# EAGLE design smc (EAGLE 9.6.2)
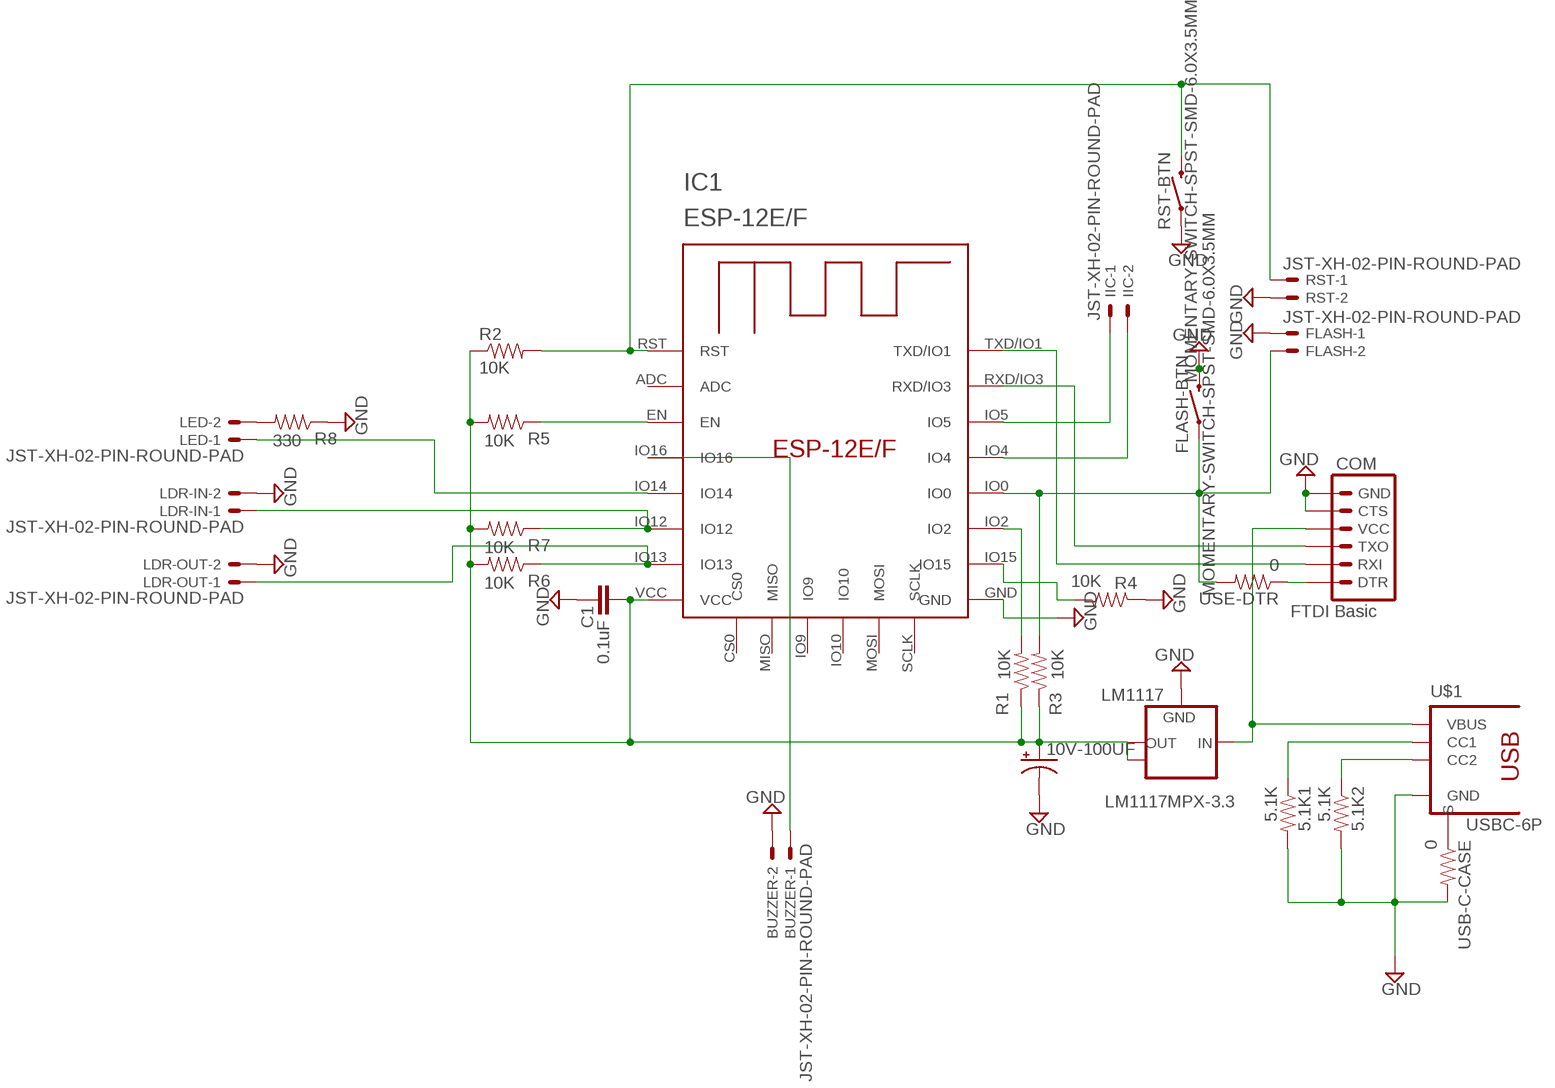
[diagram p0: schematic, sheet 1]

## Parts
5.1K1  5.1K  RESISTOR0603-RES  [0603-RES]
5.1K2  5.1K  RESISTOR0603-RES  [0603-RES]
10V-100UF  CPOL-USA/3216-18W  [A/3216-18W]
BUZZER  JST-XH-02-PIN-ROUND-PAD  [JST-XH-02-PACKAGE-ROUND-PAD]
C1  0.1uF  CAP0603-CAP  [0603-CAP]
COM  FTDI Basic  ARDUINO_SERIAL_PROGRAMPTH  [1X06]
FLASH  JST-XH-02-PIN-ROUND-PAD  [JST-XH-02-PACKAGE-ROUND-PAD]
FLASH-BTN  MOMENTARY-SWITCH-SPST-SMD-6.0X3.5MM  [TACTILE_SWITCH_SMD_6.0X3.5MM]
IC1  ESP-12E/F  [ESP-12E]
IIC  JST-XH-02-PIN-ROUND-PAD  [JST-XH-02-PACKAGE-ROUND-PAD]
LDR-IN  JST-XH-02-PIN-ROUND-PAD  [JST-XH-02-PACKAGE-ROUND-PAD]
LDR-OUT  JST-XH-02-PIN-ROUND-PAD  [JST-XH-02-PACKAGE-ROUND-PAD]
LED  JST-XH-02-PIN-ROUND-PAD  [JST-XH-02-PACKAGE-ROUND-PAD]
LM1117  LM1117MPX-3.3  [SOT223]
R1  10K  RESISTOR0603-RES  [0603-RES]
R2  10K  RESISTOR0603-RES  [0603-RES]
R3  10K  RESISTOR0603-RES  [0603-RES]
R4  10K  RESISTOR0603-RES  [0603-RES]
R5  10K  RESISTOR0603-RES  [0603-RES]
R6  10K  RESISTOR0603-RES  [0603-RES]
R7  10K  RESISTOR0603-RES  [0603-RES]
R8  330  RESISTOR0603-RES  [0603-RES]
RST  JST-XH-02-PIN-ROUND-PAD  [JST-XH-02-PACKAGE-ROUND-PAD]
RST-BTN  MOMENTARY-SWITCH-SPST-SMD-6.0X3.5MM  [TACTILE_SWITCH_SMD_6.0X3.5MM]
U$1  USBC-6P  [USCX-06FX-XXMX-01]
USB-C-CASE  0  RESISTOR0603-RES  [0603-RES]
USE-DTR  0  RESISTOR0603-RES  [0603-RES]

## Nets
3V3: 10V-100UF.+ C1.1 IC1.VCC LM1117.2(OUT) LM1117.TAB(OUT1) R1.1 R2.1 R3.1 R5.2 R6.2 R7.2
5V: COM.4(VCC) LM1117.3(IN) U$1.VBUS1(VBUS) U$1.VBUS2(VBUS)
GND: 5.1K1.2 5.1K2.2 10V-100UF.- BUZZER.2 C1.2 COM.5(CTS) COM.6(GND) FLASH-BTN.2 FLASH.1 IC1.GND LDR-IN.2 LDR-OUT.2 LM1117.1(GND) R4.1 R8.1 RST-BTN.1 RST.2 U$1.GND1(GND) U$1.GND2(GND) USB-C-CASE.2
IO0: FLASH-BTN.1 FLASH.2 IC1.IO0 R3.2 USE-DTR.2
IO2: IC1.IO2 R1.2
N$1: IC1.IO15 R4.2
N$2: IC1.EN R5.1
N$3: IC1.IO12 LDR-IN.1 R7.1
N$4: IC1.IO13 LDR-OUT.1 R6.1
N$5: LED.2 R8.2
N$6: COM.3(TXO) IC1.RXD/IO3
N$7: COM.2(RXI) IC1.TXD/IO1
N$8: COM.1(DTR) USE-DTR.1
N$9: U$1.SHIELD1(S) U$1.SHIELD2(S) U$1.SHIELD3(S) U$1.SHIELD4(S) USB-C-CASE.1
N$10: IC1.IO14 LED.1
N$11: 5.1K2.1 U$1.CC2
N$12: 5.1K1.1 U$1.CC1
N$13: BUZZER.1 IC1.IO16
N$14: IC1.IO5 IIC.1
N$15: IC1.IO4 IIC.2
RST: IC1.RST R2.2 RST-BTN.2 RST.1
Unconnected: IC1.ADC IC1.CS0 IC1.IO9 IC1.IO10 IC1.MISO IC1.MOSI IC1.SCLK

## Library data of the parts
5.1K1 5.1K2 R1-R8 USB-C-CASE USE-DTR = SparkFun:RESISTOR: Resistor Basic schematic elements and footprints for 0603, 1206, and PTH resistors.
10V-100UF = rcl:CPOL-US: POLARIZED CAPACITOR, American symbol; SPICEPREFIX: C
BUZZER FLASH IIC LDR-IN LDR-OUT LED RST = Rembrandt Electronics - JST XH Connectors v1-0:JST-XH-02-PIN: JST XH Connector 2 Pin Wire to board connector. Pitch: 2,54 mm, (0.100") Number of pins: 2 Created by Rembrandt Electronics www.rembrandtelectronics.com
C1 = SparkFun:CAP: Capacitor Standard 0603 ceramic capacitor, and 0.1" leaded capacitor.
COM = SparkFun:ARDUINO_SERIAL_PROGRAM
FLASH-BTN RST-BTN = SparkFun-Switches:MOMENTARY-SWITCH-SPST: Momentary Switch (Pushbutton) - SPST Normally-open (NO) SPST momentary switches (buttons, pushbuttons). Variants PTH-12MM - 12mm square, through-hole Momentary Pushbutton Switch - 12mm Square <https://www.sparkfun.com/products/9190> (COM-09190) PTH-6.0MM, PTH-6.0MM-KIT - 6.0mm square, through-hole Mini Pushbutton Switch <https://www.sparkfun.com/products/97> (COM-00097) KIT package intended for soldering kit's - only one side of pads' copper is exposed. PTH-RIGHT-ANGLE-KIT - Right-angle, through-hole Right Angle Tactile Button <https://www.sparkfun.com/products/10791> - Used on SparkFun BigTime Watch Kit <https://www.sparkfun.com/products/11734> SMD-12MM - 12mm square, surface-mount Tactile Button - SMD (12mm) <https://www.sparkfun.com/products/12993> (COM-12993) Used on SparkFun PicoBoard <https://www.sparkfun.com/products/11888> SMD-4.5MM - 4.5mm Square Trackball Switch Used on SparkFun Blackberry Trackballer Breakout <https://www.sparkfun.com/products/13169> SMD-4.6MMX2.8MM - 4.60mm x 2.80mm, surface mount Used on SparkFun SAMD21 Mini Breakout <https://www.sparkfun.com/products/13664> SMD-5.2MM, SMD-5.2-REDUNDANT - 5.2mm square, surface-mount Mini Pushbutton Switch - SMD <https://www.sparkfun.com/products/8720> (COM-08720) Used on Arduino Pro Mini <https://www.sparkfun.com/products/11114> REDUNDANT package connects both switch circuits together SMD-6.0X3.5MM - 6.0 x 3.5mm, surface mount Momentary Reset Switch SMD <https://www.sparkfun.com/products/8229> (COM-08229) SMD-6.2MM-TALL - 6.2mm square, surface mount Tactile Button - SMD (6mm) <https://www.sparkfun.com/products/12992> Used on SparkFun Digital Sandbox <https://www.sparkfun.com/products/12651> SMD-RIGHT-ANGLE - Right-angle, surface mount Used on SparkFun Block for Intel® Edison - Arduino <https://www.sparkfun.com/products/13036>; PROD_ID: SWCH-00815; SF_SKU: COM-08229
IC1 = esp-12e-f:ESP-12E/F
LM1117 = lm1117:LM1117MPX-*
U$1 = USBC6P:USBC-6P: AliExpress Special! Connect 5.1k 10% resistors to each CC pin, pulled up to 3.3v or 5.0v.

## Board
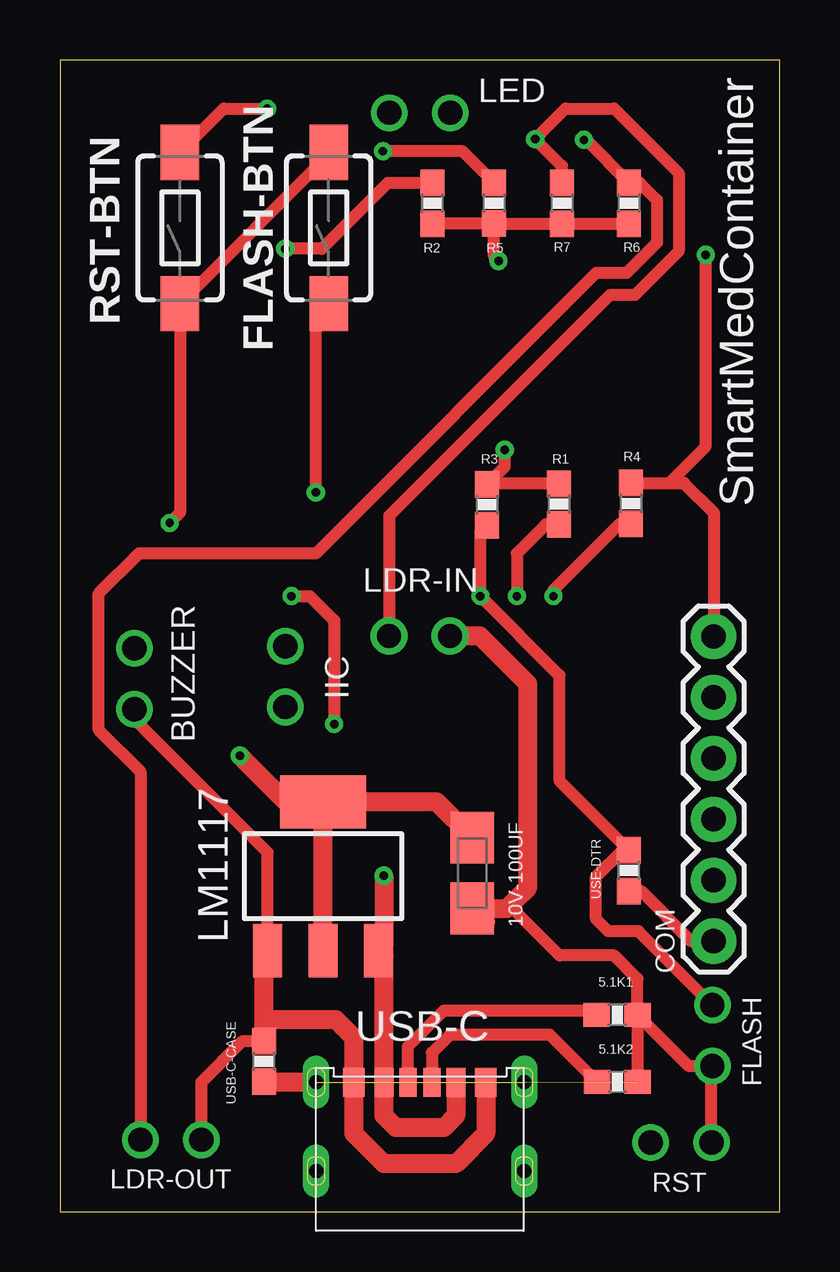
[diagram p1: board, top side]
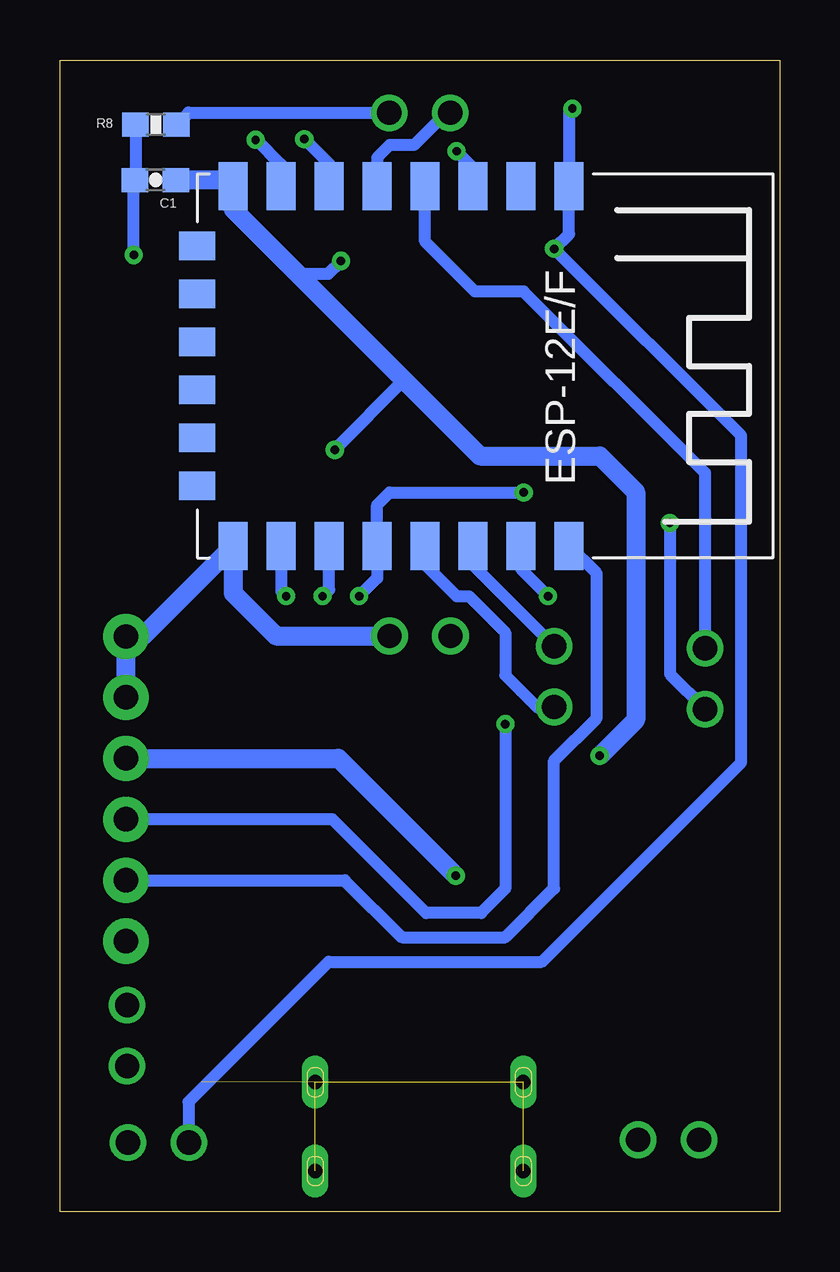
[diagram p2: board, bottom side, seen from below]

Size 30 x 48 mm. Coordinates in mm from the lower left corner, seen from the top.
Outline: 0,0 30,0 30,48 0,48 0,0
Copper layers (1*16): Top 0.035mm / dielectric 1.5mm / Bottom 0.035mm
Design rules "default *": minimum track width 6mil, minimum drill 0.35mm, track to track 10mil, track to pad 8mil, pad to pad 6mil, via to via 10mil, smd to smd 10mil, copper to edge 40mil, drill to drill 8mil, minimum pad ring 10mil, minimum via ring 8mil, stop-mask expansion 4mil, vias tented up to drill 0mil, thermal gap 10mil

### Footprints (pad centres in the part's own frame; a part is rotated, then mirrored left to right if it is on the bottom)
0603-RES = smd 1.1 x 1: 1 -0.85,0; 2 0.85,0
A/3216-18W = smd 2.15 x 1.8: + 1.475,0; - -1.475,0
JST-XH-02-PACKAGE-ROUND-PAD = drill 1.016: 1 -1.27,0; 2 1.27,0
0603-CAP = smd 1.1 x 1: 1 -0.85,0; 2 0.85,0
1X06 = drill 1.016 pad 1.88: 1 0,0; 2 2.54,0; 3 5.08,0; 4 7.62,0; 5 10.16,0; 6 12.7,0
TACTILE_SWITCH_SMD_6.0X3.5MM = smd 2.3 x 1.6: 1 -3.15,0; 2 3.15,0
ESP-12E = smd 2 x 1.2: ADC -7.46,5.53; EN -7.46,3.53; GND 7.54,-6.47; IO0 7.54,-0.47; IO2 7.54,-2.47; IO4 7.54,1.53; IO5 7.54,3.53; IO12 -7.46,-2.47; IO13 -7.46,-4.47; IO14 -7.46,-0.47; IO15 7.54,-4.47; IO16 -7.46,1.53; RST -7.46,7.53; RXD/IO3 7.54,5.53; TXD/IO1 7.54,7.53; VCC -7.46,-6.47 | smd 1.2 x 1.5: CS0 -4.96,-7.97; IO9 -0.96,-7.97; IO10 1.04,-7.97; MISO -2.96,-7.97; MOSI 3.04,-7.97; SCLK 5.04,-7.97
SOT223 = smd 1.219 x 2.235: 1 -2.311,-3.099; 2 0,-3.099; 3 2.311,-3.099 | smd 3.6 x 2.2: TAB 0,3.099
USCX-06FX-XXMX-01 = smd 0.7 x 1.2: CC1 0.5,-1.75; CC2 -0.5,-1.75 | smd 0.9 x 1.2: GND1 2.75,-1.75; GND2 -2.75,-1.75 | drill 0.6 long: SHIELD1 4.325,1.95; SHIELD2 4.325,-1.75; SHIELD3 -4.35,-1.75; SHIELD4 -4.35,1.95 | smd 0.8 x 1.2: VBUS1 1.5,-1.75; VBUS2 -1.5,-1.75

### Placement (x,y rotation side)
5.1K1  23.23,8.2 0 top
5.1K2  23.24,5.4 0 top
10V-100UF  17.19,14.11 90 top
BUZZER  3.1,22.21 270 top
C1  26.02,43 180 bottom
COM  27.25,11.27 90 top
FLASH  27.2,7.33 90 top
FLASH-BTN  11.2,41 90 top
IC1  16.31,35.29 270 bottom
IIC  9.4,22.3 270 top
LDR-IN  14.99,23.99 0 top
LDR-OUT  4.63,2.99 0 top
LED  15,45.8 0 top
LM1117  10.97,13.98 0 top
R1  20.8,29.49 270 top
R2  15.53,42.02 90 top
R3  17.8,29.46 270 top
R4  23.8,29.52 270 top
R5  18.1,42.03 270 top
R6  23.73,42.02 270 top
R7  20.94,42.02 270 top
R8  26,45.3 0 bottom
RST  25.89,2.88 0 top
RST-BTN  5,41 90 top
U$1  15.01,3.64 180 top
USB-C-CASE  8.5,6.26 90 top
USE-DTR  23.72,14.21 90 top

### Tracks (layer width: path | path; a pad name or v marks a point on that pad's centre or on a via)
3V3  (via drill 0.35)
  Top 0.5: v18.29,39.62 18.1,39.81 R5.2 | R5.2 R7.2 R6.2 | R5.2 R2.1 | R1.1 17.83,30.34 R3.1 18.54,31.05 v18.54,31.75
  Top 0.8: LM1117.2 LM1117.TAB | 10V-100UF.+ 15.7,17.08 LM1117.TAB | v7.5,19 9.42,17.08 LM1117.TAB
  Bottom 0.5: 20.09,39.09 18.82,39.09 v18.29,39.62 | v18.54,31.75 15.65,34.65
  Bottom 0.8: C1.1 23.03,43 IC1.VCC 22.78,41.78 20.09,39.09 15.65,34.65 12.5,31.5 7.5,31.5 6,30 6,20.5 v7.5,19
5V  (via drill 0.35)
  Top 0.8: 13.51,10.66 13.5,10.65 U$1.VBUS1 13.51,4 14,3.5 16,3.5 16.5,4 U$1.VBUS2 | v13.5,14 13.5,11.1 LM1117.3
  Top 0.813: 13.51,10.66 LM1117.3
  Bottom 0.8: COM.4 18.39,18.89 v13.5,14
GND  (via drill 0.35)  (1 unrouted)
  Top 0.5: RST.2 27.16,6.02 FLASH.1 26.22,6.06 5.1K1.2 | 5.1K2.2 5.1K1.2 | 5.1K1.2 24.08,9.7 23.11,10.67 20.83,10.67 19,12.49 19,13 | LDR-OUT.2 5.9,5.39 7.62,7.11 USB-C-CASE.2 | LM1117.1 8.66,14.96 3.1,20.52 BUZZER.2 | R4.1 25.4,30.37 | 25.4,30.37 26.02,30.37 27.25,29.14 COM.6 | 25.4,30.37 26.92,31.89 v26.92,39.88 | v4.57,28.7 5,29.13 RST-BTN.1 11.2,44.05 FLASH-BTN.2
  Top 0.8: USB-C-CASE.2 8.5,8 | 8.5,8 8.5,10.72 LM1117.1 | 8.5,8 11.5,8 12.26,7.25 U$1.GND1 12.26,3.25 13.5,2 16.5,2 17.75,3.25 U$1.GND2 | 17.75,12.07 10V-100UF.- 18.64,12.63 19,13 19.5,13.5 19.5,22 17.51,23.99 LDR-IN.2 16.28,23.97
  Bottom 0.5: v26.92,39.88 26.92,42.95 C1.2 26.85,43.02 R8.1 | v4.57,28.7 4.57,22.41 BUZZER.2
  Bottom 0.8: COM.5 COM.6 26.56,23.97 IC1.GND 22.78,25.78 20.99,23.99 LDR-IN.2
IO0  (via drill 0.35)
  Top 0.5: FLASH.2 24.12,11.68 22.86,11.68 22.35,12.19 22.35,13.97 23.44,15.06 USE-DTR.2 20.83,17.95 20.83,22.35 v17.53,25.65 17.53,28.34 R3.2 | v10.67,29.97 10.67,37.32 FLASH-BTN.1
  Bottom 0.5: v17.53,25.65 16.78,26.4 IC1.IO0 16.78,29.45 16.26,29.97 v10.67,29.97
IO2  (via drill 0.35)
  Top 0.5: R1.2 20.26,28.64 19.05,27.43 v19.05,25.65
  Bottom 0.5: v19.05,25.65 18.78,25.92 IC1.IO2
N$1  (via drill 0.35)
  Top 0.5: v20.57,25.65 20.57,25.91 23.34,28.67 R4.2
  Bottom 0.5: IC1.IO15 20.78,25.86 v20.57,25.65
N$2  (via drill 0.35)
  Top 0.5: R5.1 16.78,44.2 v13.46,44.2
  Bottom 0.5: v13.46,44.2 12.78,43.51 IC1.EN
N$3  (via drill 0.35)
  Top 0.5: R7.1 20.93,43.58 v19.81,44.7 21.08,45.97 23.11,45.97 25.8,43.29 25.8,40.02 23.98,38.2 22.93,38.2 13.72,28.99 LDR-IN.1
  Bottom 0.5: v19.81,44.7 18.78,43.67 IC1.IO12
N$4  (via drill 0.35)
  Top 0.5: v21.84,44.67 21.93,44.67 R6.1 24.18,42.87 24.89,42.16 24.89,40.39 23.62,39.12 22.35,39.12 10.67,27.43 3.3,27.43 1.6,25.73 1.6,20.1 3.36,18.34 LDR-OUT.1
  Bottom 0.5: IC1.IO13 20.78,43.64 21.81,44.67 v21.84,44.67
N$5
  Bottom 0.5: LED.2 24.64,45.81 R8.2
N$6  (via drill 0.35)
  Top 0.5: v9.65,25.65 10.41,25.65 11.43,24.64 v11.43,20.32
  Bottom 0.5: IC1.RXD/IO3 10.78,26.78 v9.65,25.65 | v11.43,20.32 11.43,13.46 12.45,12.45 14.73,12.45 18.64,16.35 COM.3
N$7
  Bottom 0.5: COM.2 18.13,13.81 15.75,11.43 11.43,11.43 9.4,13.46 9.4,18.8 7.62,20.57 7.62,26.59 IC1.TXD/IO1
N$8
  Top 0.5: COM.1 26.32,11.27 24.23,13.36 USE-DTR.1
N$9  (3 unrouted)
  Top 0.8: U$1.SHIELD2 8.52,5.39
  Top 0.813: 8.52,5.39 USB-C-CASE.1
N$10
  Bottom 0.5: LED.1 13.89,45.8 15.24,44.45 16.26,44.45 16.78,43.93 IC1.IO14
N$11
  Top 0.5: 5.1K2.1 20.42,7.37 16.26,7.37 15.51,6.62 U$1.CC2
N$12
  Top 0.5: U$1.CC1 14.51,6.88 16,8.38 22.2,8.38 5.1K1.1
N$13
  Bottom 0.5: BUZZER.1 3.1,30.79 10.67,38.35 12.7,38.35 14.78,40.43 IC1.IO16
N$14
  Bottom 0.5: IIC.1 12.78,26.95 IC1.IO5
N$15
  Bottom 0.5: IC1.IO4 14.78,26.97 13.46,25.65 12.95,25.65 11.43,24.13 11.43,22.35 10.11,21.03 IIC.2
RST  (via drill 0.35)
  Top 0.5: RST-BTN.2 6.82,45.97 v8.64,45.97 | R2.2 13.66,42.87 10.92,40.13 v9.4,40.13
  Bottom 0.5: v8.64,45.97 8.78,45.83 IC1.RST 8.78,40.75 v9.4,40.13 1.6,32.33 1.6,18.72 9.91,10.41 18.8,10.41 24.64,4.57 24.62,4.55 RST.1

### Text on the board
tNames: SmartMedContainer | USB-C